# EasyEDA schematic SCH_WHITEBoard ESP32 S2 Saola_2021-06-30.json

## Sheets
1 Sheet_1: TITLE: ESP32 S2 Saola; REV: 1.0; Date: 2020-12-30; Sheet: 1/1; Drawn By: dekip; Company: Your Company
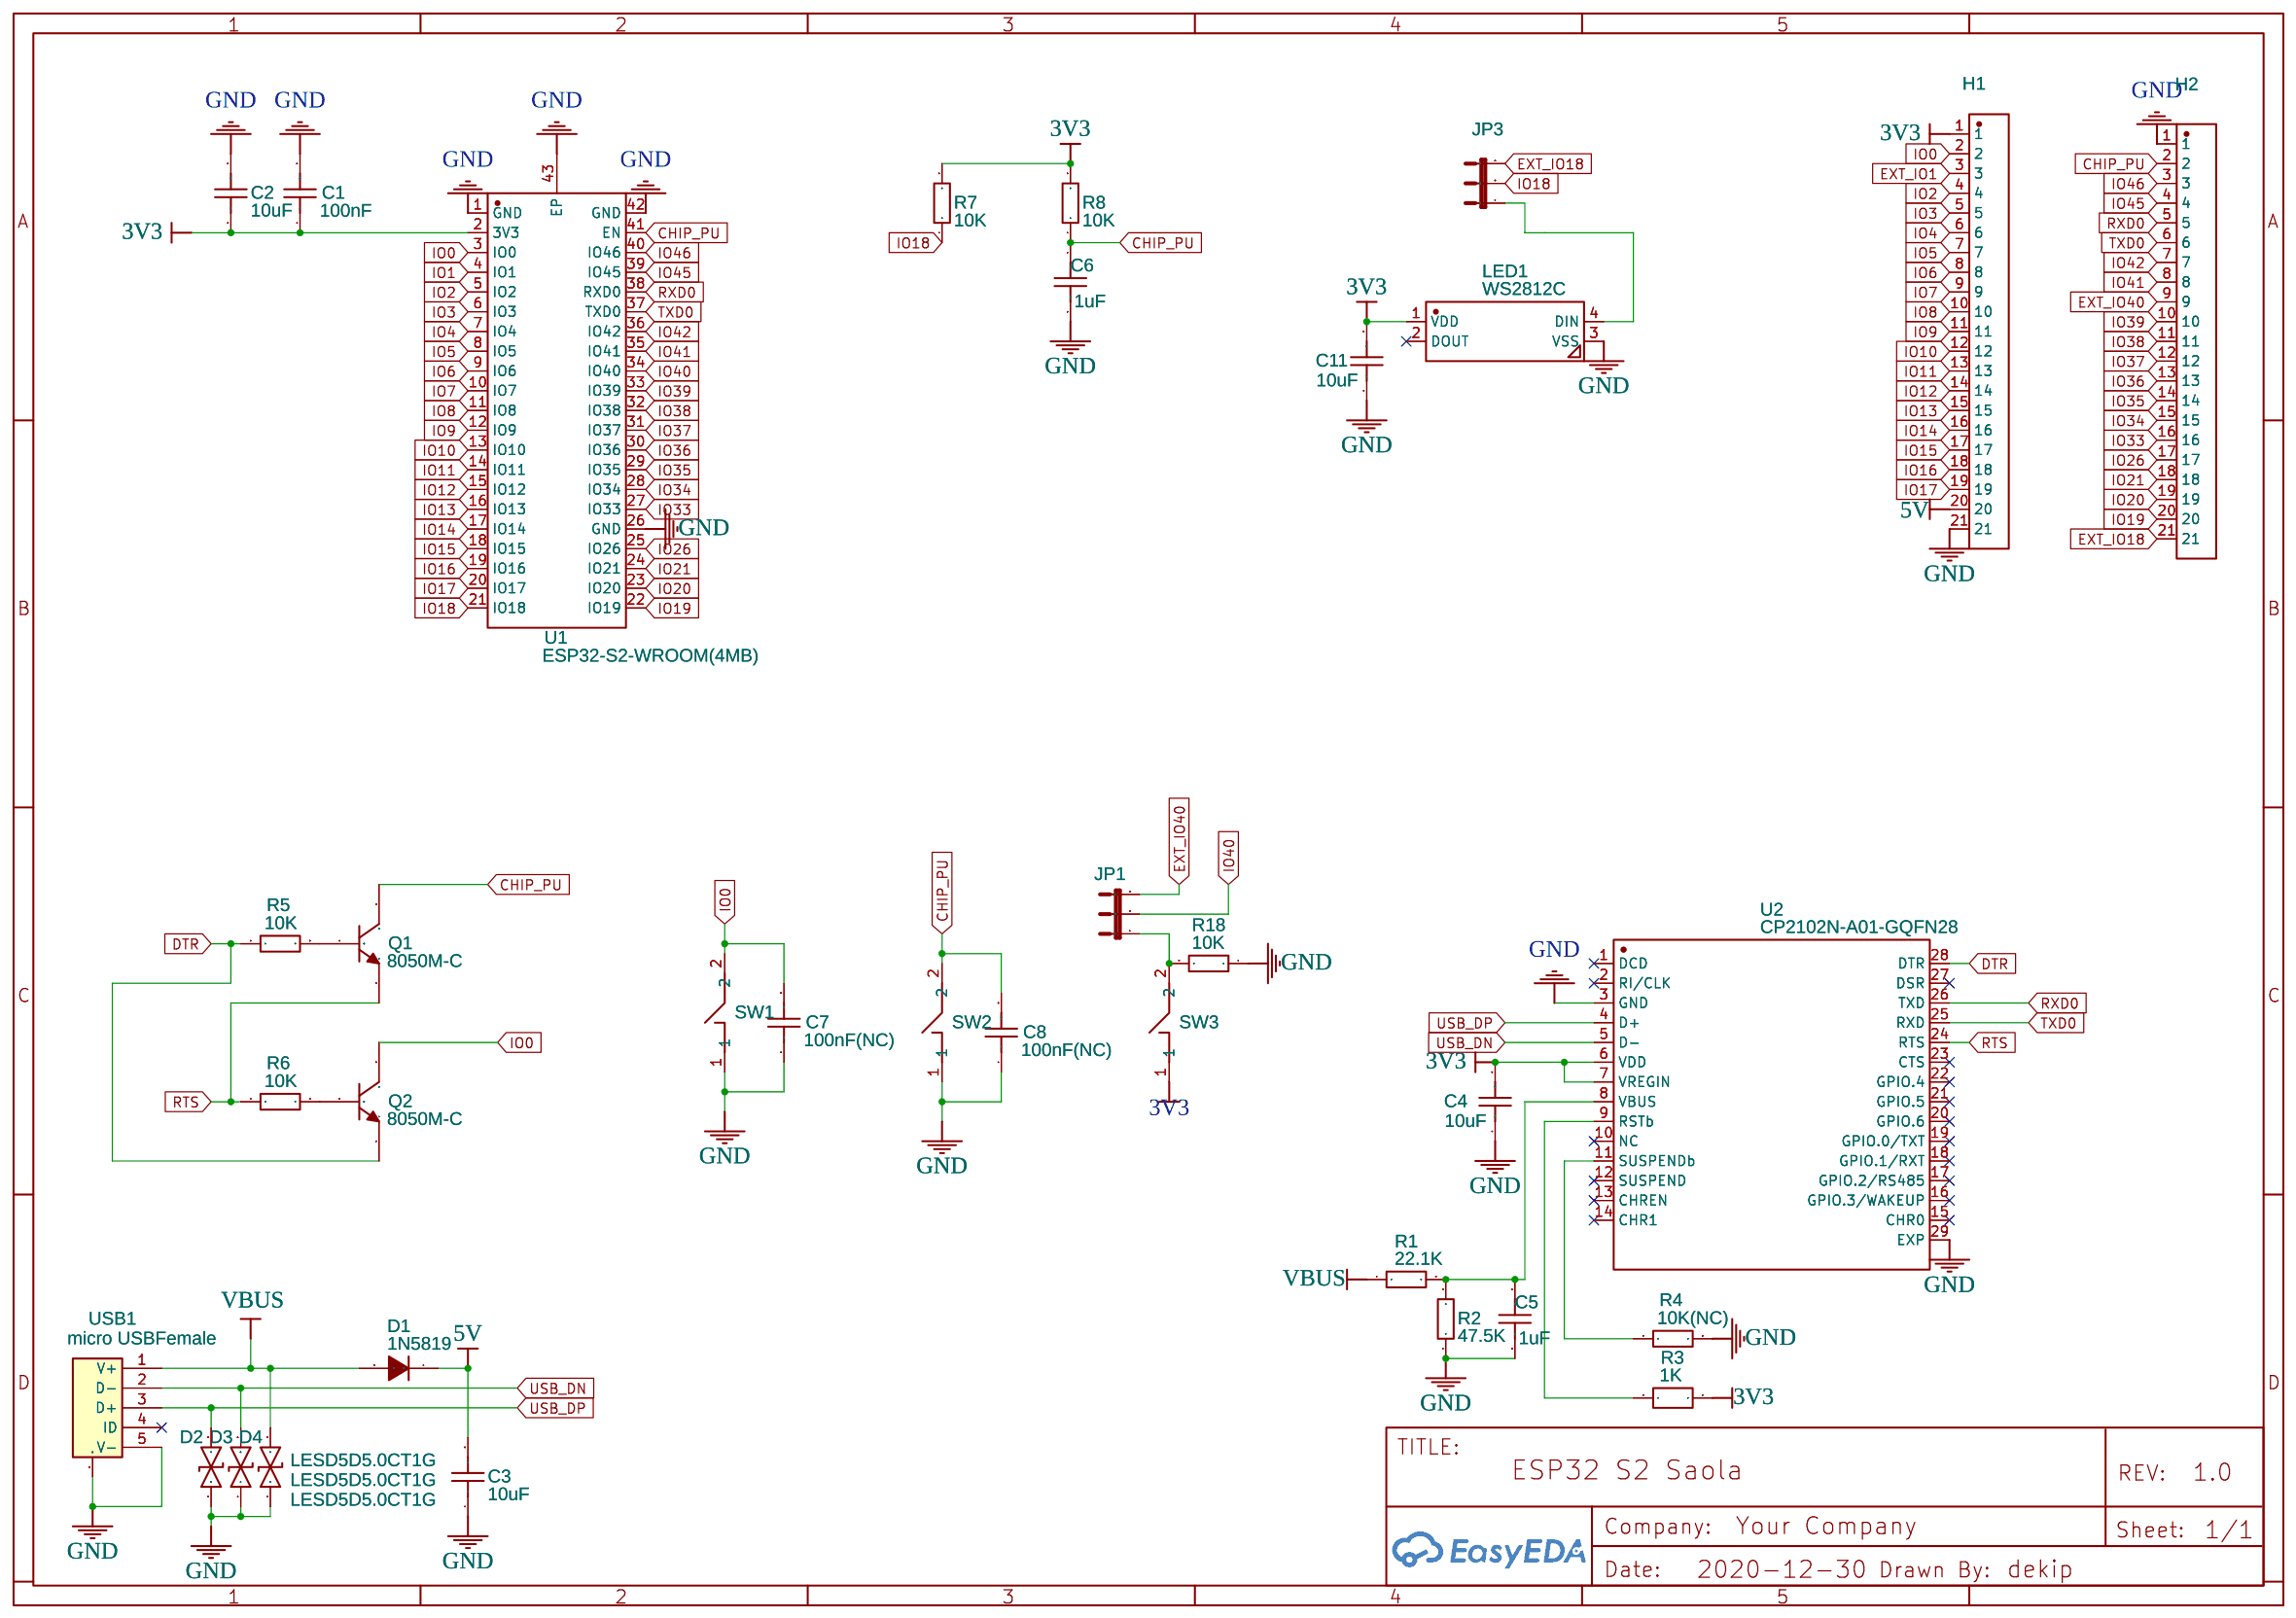
[diagram p0: Sheet_1]
2 Sheet_2: TITLE: Sheet_2; Date: 2020-12-31
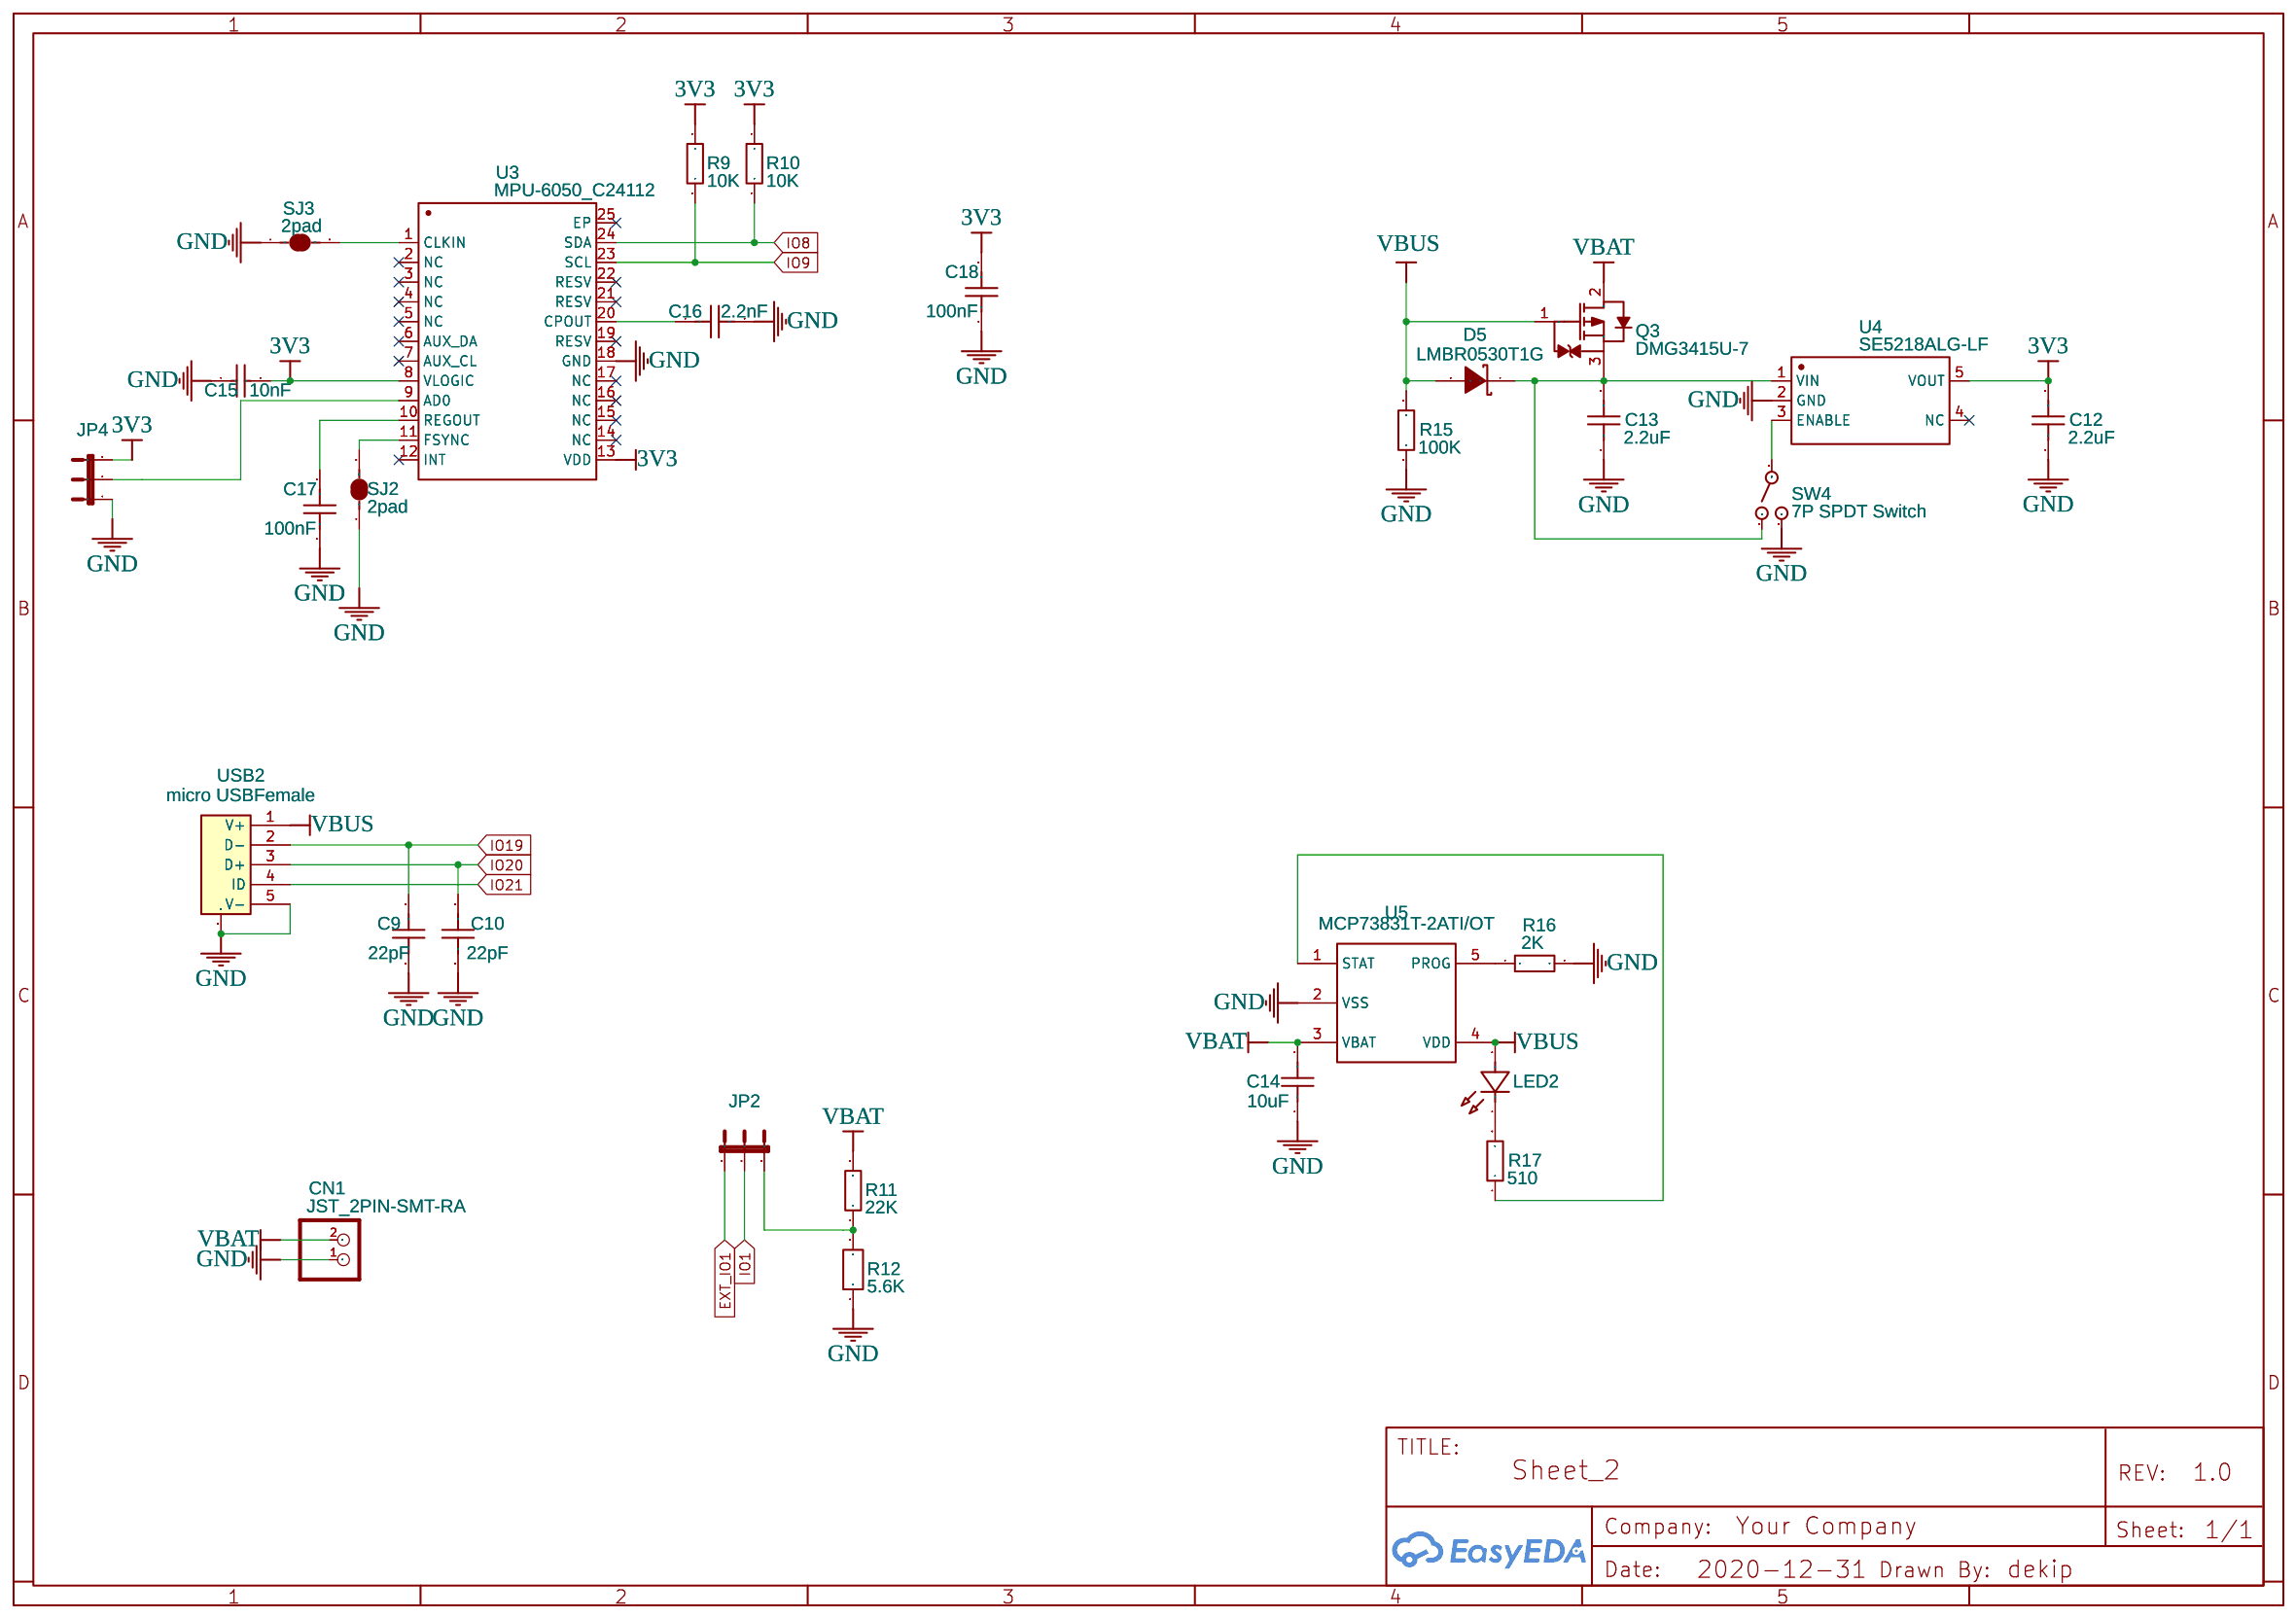
[diagram p1: Sheet_2]

## Parts
sheet Sheet_1
C1  100nF  [C0805]
C2  10uF  [C0805]
C3  10uF  [C0805]
C4  10uF  [C0805]
C5  1uF  [C0805]
C6  1uF  [C0805]
C7  100nF(NC)  [C0805]
C8  100nF(NC)  [C0805]
C11  10uF  [C0805]
D1  1N5819  [SOD-123F_L2.8-W1.8-LS3.7-RD]
D2  LESD5D5.0CT1G  [SOD-523_L1.2-W0.8-LS1.6-BI]
D3  LESD5D5.0CT1G  [SOD-523_L1.2-W0.8-LS1.6-BI]
D4  LESD5D5.0CT1G  [SOD-523_L1.2-W0.8-LS1.6-BI]
H1  X6511WV-21H-C30D60  [HDR-TH_21P-P2.54-V-M]
H2  X6511WV-21H-C30D60  [HDR-TH_21P-P2.54-V-M]
JP1  JUMPER-3SMD  [SJ_3]
JP3  JUMPER-3SMD  [SJ_3]
LED1  WS2812C  [LED-SMD_4P-L5.0-W5.0-TL]
Q1  8050M-C  [SOT-23-3_L3.0-W1.7-P0.95-LS2.9-BR]
Q2  8050M-C  [SOT-23-3_L3.0-W1.7-P0.95-LS2.9-BR]
R1  22.1K  [R0805]
R2  47.5K  [R0805]
R3  1K  [R0805]
R4  10K(NC)  [R0805]
R5  10K  [R0805]
R6  10K  [R0805]
R7  10K  [R0805]
R8  10K  [R0805]
R18  10K  [R0805]
SW1  1TS002B-1900-4300  [SW-SMD_L6.0-W3.5-LS8.0]
SW2  1TS002B-1900-4300  [SW-SMD_L6.0-W3.5-LS8.0]
SW3  1TS002B-1900-4300  [SW-SMD_L6.0-W3.5-LS8.0]
U1  ESP32-S2-WROOM(4MB)  [WIFI-SMD_ESP32-S2-WROVER-I]
U2  CP2102N-A01-GQFN28  [QFN-28_L5.0-W5.0-P0.50-BL-EP3.3]
USB1  micro USBFemale  [MICRO-USB-SMD_5P-P0.65-H-F_C10418]
sheet Sheet_2
C9  22pF  [C0805]
C10  22pF  [C0805]
C12  2.2uF  [C0805]
C13  2.2uF  [C0805]
C14  10uF  [C0805]
C15  10nF  [C0805]
C16  2.2nF  [C0805]
C17  100nF  [C0805]
C18  100nF  [C0805]
CN1  JST_2PIN-SMT-RA  [JST-PH-2-SMT-RA]
D5  LMBR0530T1G  [SOD-123_L2.8-W1.8-LS3.7-RD]
JP2  JUMPER-3SMD  [SJ_3]
JP4  JUMPER-3SMD  [SJ_3]
LED2  GBD-C171KSKT-DZ  [LED0805-RD]
Q3  DMG3415U-7  [SOT-23-3_L2.9-W1.6-P1.90-LS2.8-BR-CW]
R9  10K  [R0805]
R10  10K  [R0805]
R11  22K  [R0805]
R12  5.6K  [R0805]
R15  100K  [R0805]
R16  2K  [R0805]
R17  510  [R0805]
SJ2  2pad  [SJ_2S-TRACE]
SJ3  2pad  [SJ_2S-TRACE]
SW4  7P SPDT Switch  [SW-TH_MSK12C02]
U3  MPU-6050_C24112  [QFN-24_L4.0-W4.0-P0.50-BL-EP2.6]
U4  SE5218ALG-LF  [SOT-23-5_L3.0-W1.7-P0.95-LS2.8-BR]
U5  MCP73831T-2ATI/OT  [SOT-23-5_L3.0-W1.7-P0.95-LS2.8-BR]
USB2  micro USBFemale  [MICRO-USB-SMD_5P-P0.65-H-F_C10418]

## Library data of the parts
C1 C7 C8 C17 C18 = C0805C104J5RAC7800: Supplier: LCSC; Supplier Part: C599848; Manufacturer: KEMET; Contributor: LCSC
C2-C4 C11 C14 = C0805X106K010T: Supplier: LCSC; Supplier Part: C340314; Manufacturer: Holy Stone Enterprise; Contributor: LCSC
C5 C6 = C0805X105K050T: Supplier: LCSC; Supplier Part: C340303; Manufacturer: Holy Stone Enterprise; Contributor: LCSC
D1 = 1N5819HW1-7-F: Supplier: LCSC; Manufacturer: DIODES; Contributor: LCSC; Supplier Part: C117948; LCSC Assembly: Yes; SMT Type: Extend
D2-D4 = LESD5D5.0CT1G: Supplier: LCSC; Supplier Part: C383211; Manufacturer: Leshan Radio; Contributor: LCSC; SMT Type: Extend; JLCPCB SMD: Yes
H1 H2 = X6511WV-21H-C30D60: Supplier: LCSC; Supplier Part: C725953; Manufacturer: XKB Connectivity; Contributor: LCSC
JP1-JP4 = JUMPER-3SMD: Contributor: SparkFun
LED1 = WS2812C: Supplier: LCSC; Manufacturer: Worldsemi; Contributor: LCSC; Supplier Part: C114587; SMT Type: Extend; JLCPCB SMD: Yes
Q1 Q2 = 8050M-C: Supplier: LCSC; Supplier Part: C305454; Manufacturer: BLUE ROCKET; Contributor: LCSC
R1 = CR0805-FX-2212ELF: Supplier: LCSC; Supplier Part: C204311; Manufacturer: BOURNS; Contributor: LCSC
R2 = AR05DTCW4752: Supplier: LCSC; Supplier Part: C319613; Manufacturer: Viking Tech; Contributor: LCSC
R3 = ERJPB6B1001V: Supplier: LCSC; Supplier Part: C413712; Manufacturer: PANASONIC; Contributor: LCSC
R4-R10 R18 = RN73H2ATTD1002B25: Supplier: LCSC; Supplier Part: C186277; Manufacturer: KOA Speer Elec; Contributor: LCSC
SW1-SW3 = 1TS002B-1900-4300: Supplier: LCSC; Supplier Part: C318823; Manufacturer: HYP; Contributor: LCSC
U1 = ESP32-S2-WROOM(4MB): Supplier: LCSC; Supplier Part: C701327; Manufacturer: Espressif Systems; Contributor: LCSC
U2 = CP2102N-A01-GQFN28: Supplier: LCSC; Manufacturer: SILICON LABS; Contributor: LCSC; Supplier Part: C105167; SMT Type: Extend; JLCPCB SMD: Yes
USB1 USB2 = micro USBFemale: Supplier: LCSC; Manufacturer: ValuePro; image: //image.lceda.cn/szlcsc/C10418.jpg; Supplier Part: C10418
C9 C10 = C0805C220K5RACAUTO: Supplier: LCSC; Supplier Part: C129647; Manufacturer: KEMET; Contributor: LCSC
C12 C13 = CC0805MRY5V7BB225: Supplier: LCSC; Supplier Part: C527243; Manufacturer: YAGEO; Contributor: LCSC
C15 = C0805X103K201T: Supplier: LCSC; Manufacturer: HEC; Supplier Part: C105948
C16 = C0805X222K501T: Supplier: LCSC; Supplier Part: C340306; Manufacturer: Holy Stone Enterprise; Contributor: LCSC
CN1 = JST_2PIN-SMT-RA: JST 2-Pin Connectors of various flavors; Contributor: Adafruit
D5 = LMBR0530T1G: Supplier: LCSC; Manufacturer: LRC; image: //image.lceda.cn/szlcsc/C18863.jpg; Supplier Part: C18863; SMT Type: Extend; JLCPCB SMD: Yes
LED2 = GBD-C171KSKT-DZ: Supplier: LCSC; Supplier Part: C712082; Manufacturer: GBG; Contributor: LCSC
Q3 = DMG3415U-7: Supplier: LCSC; Supplier Part: C96616; Manufacturer: Diodes Incorporated; Contributor: LCSC; SMT Type: Extend; JLCPCB SMD: Yes
R11 = 0805W8F2202T5E: Supplier: LCSC; Manufacturer: UniOhm; Supplier Part: C17560; SMT Type: Basic; JLCPCB SMD: Yes
R12 = ERJ6GEYJ562V: Supplier: LCSC; Supplier Part: C413194; Manufacturer: PANASONIC; Contributor: LCSC
R15 = ERJ6RBD1003V: Supplier: LCSC; Supplier Part: C336855; Manufacturer: PANASONIC; Contributor: LCSC
R16 = RMS10FT2001: Supplier: LCSC; Supplier Part: C212356; Manufacturer: TA-I Tech; Contributor: LCSC
R17 = RMC08055105%N: Supplier: LCSC; Supplier Part: C269737; Manufacturer: Tyohm; Contributor: LCSC
SJ2 SJ3 = SOLDERJUMPER-OLDTRACE: Solder Jumper; Contributor: SparkFun
SW4 = 7P SPDT Switch: Supplier: LCSC; Supplier Part: C431540; Manufacturer: SHOU HAN; Manufacturer Part: MSK12C02; Contributor: LCSC
U3 = MPU-6050_C24112: sourceId: 1T5FDZYC8; Supplier: LCSC; Manufacturer: InvenSense; Manufacturer Part: MPU-6050; image: //image.lceda.cn/szlcsc/C24112.jpg; Supplier Part: C24112; SMT Type: Basic; JLCPCB SMD: Yes
U4 = SE5218ALG-LF: Supplier: LCSC; Manufacturer: SEAWARD; Supplier Part: C118233; SMT Type: Extend; JLCPCB SMD: Yes
U5 = MCP73831T-2ATI/OT: Supplier: LCSC; Manufacturer: MICROCHIP; image: //image.lceda.cn/szlcsc/C14879.jpg; Supplier Part: C14879; SMT Type: Extend; JLCPCB SMD: Yes

## Nets
3V3: C1.1 C2.1 C4.2 C11.2 C12.2 C15.2 C18.2 H1.1 JP4.3 LED1.1(VDD) R3.2 R7.2 R8.2 R9.1 R10.1 SW3.1 U1.2(3V3) U2.6(VDD) U2.7(VREGIN) U3.8(VLOGIC) U3.13(VDD) U4.5(VOUT)
5V: C3.2 D1.1(K) H1.20
GND: C1.2 C2.2 C3.1 C4.1 C5.2 C6.2 C7.1 C8.1 C9.2 C10.2 C11.1 C12.1 C13.1 C14.1 C15.1 C16.2 C17.1 C18.1 CN1.1(2) D2.1 D3.1 D4.1 H1.21 H2.1 JP4.1 LED1.3(VSS) R2.1 R4.2 R12.1 R15.1 R16.2 R18.1 SJ2.1 SJ3.1 SW1.1 SW2.1 SW4.1 U1.1(GND) U1.26(GND) U1.42(GND) U1.43(EP) U2.3(GND) U2.29(EXP) U3.18(GND) U4.2(GND) U5.2(VSS) USB1.0(MTN) USB1.5(V-) USB2.0(MTN) USB2.5(V-)
VBAT: C14.2 CN1.2(1) Q3.2(D) R11.2 U5.3(VBAT)
VBUS: D1.2(A) D4.2 D5.2(A) LED2.2(A) Q3.1(G) R1.1 R15.2 U5.4(VDD) USB1.1(V+) USB2.1(V+)
CHIP_PU: C6.1 C8.2 H2.2 Q1.3(C) R8.1 SW2.2 U1.41(EN)
DTR: Q2.2(E) R5.1 U2.28(DTR)
EXT_IO1: H1.3 JP2.1
EXT_IO18: H2.21 JP3.3
EXT_IO40: H2.9 JP1.3
IO0: C7.2 H1.2 Q2.3(C) SW1.2 U1.3(IO0)
IO1: JP2.2 U1.4(IO1)
IO2: H1.4 U1.5(IO2)
IO3: H1.5 U1.6(IO3)
IO4: H1.6 U1.7(IO4)
IO5: H1.7 U1.8(IO5)
IO6: H1.8 U1.9(IO6)
IO7: H1.9 U1.10(IO7)
IO8: H1.10 R10.2 U1.11(IO8) U3.24(SDA)
IO9: H1.11 R9.2 U1.12(IO9) U3.23(SCL)
IO10: H1.12 U1.13(IO10)
IO11: H1.13 U1.14(IO11)
IO12: H1.14 U1.15(IO12)
IO13: H1.15 U1.16(IO13)
IO14: H1.16 U1.17(IO14)
IO15: H1.17 U1.18(IO15)
IO16: H1.18 U1.19(IO16)
IO17: H1.19 U1.20(IO17)
IO18: JP3.2 R7.1 U1.21(IO18)
IO19: C9.1 H2.20 U1.22(IO19) USB2.2(D-)
IO20: C10.1 H2.19 U1.23(IO20) USB2.3(D+)
IO21: H2.18 U1.24(IO21) USB2.4(ID)
IO26: H2.17 U1.25(IO26)
IO33: H2.16 U1.27(IO33)
IO34: H2.15 U1.28(IO34)
IO35: H2.14 U1.29(IO35)
IO36: H2.13 U1.30(IO36)
IO37: H2.12 U1.31(IO37)
IO38: H2.11 U1.32(IO38)
IO39: H2.10 U1.33(IO39)
IO40: JP1.2 U1.34(IO40)
IO41: H2.8 U1.35(IO41)
IO42: H2.7 U1.36(IO42)
IO45: H2.4 U1.39(IO45)
IO46: H2.3 U1.40(IO46)
RTS: Q1.2(E) R6.1 U2.24(RTS)
RXD0: H2.5 U1.38(RXD0) U2.26(TXD)
TXD0: H2.6 U1.37(TXD0) U2.25(RXD)
USB_DN: D3.2 U2.5(D-) USB1.2(D-)
USB_DP: D2.2 U2.4(D+) USB1.3(D+)
Net-(C5-1): C5.1 R1.2 R2.2 U2.8(VBUS)
Net-(C13-2): C13.2 D5.1(K) Q3.3(S) SW4.3 U4.1(VIN)
Net-(C16-1): C16.1 U3.20(CPOUT)
Net-(C17-2): C17.2 U3.10(REGOUT)
Net-(JP1-1): JP1.1 R18.2 SW3.2
Net-(JP2-3): JP2.3 R11.1 R12.2
Net-(JP3-1): JP3.1 LED1.4(DIN)
Net-(JP4-2): JP4.2 U3.9(AD0)
Net-(LED2-1): LED2.1(K) R17.2
Net-(Q1-1): Q1.1(B) R5.2
Net-(Q2-1): Q2.1(B) R6.2
Net-(R3-1): R3.1 U2.9(RSTb)
Net-(R4-1): R4.1 U2.11(SUSPENDb)
Net-(R16-1): R16.1 U5.5(PROG)
Net-(R17-1): R17.1 U5.1(STAT)
Net-(SJ2-2): SJ2.2 U3.11(FSYNC)
Net-(SJ3-2): SJ3.2 U3.1(CLKIN)
Net-(SW4-2): SW4.2(COM) U4.3(ENABLE)

Not connected (* = marked no-connect by the designer): LED1 2(DOUT)*; U2 1(DCD)* 2(RI/CLK)* 10(NC)* 12(SUSPEND)* 13(CHREN)* 14(CHR1)* 15(CHR0)* 16(GPIO.3/WAKEUP)* 17(GPIO.2/RS485)* 18(GPIO.1/RXT)* 19(GPIO.0/TXT)* 20(GPIO.6)* 21(GPIO.5)* 22(GPIO.4)* 23(CTS)* 27(DSR)*; U3 2(NC)* 3(NC)* 4(NC)* 5(NC)* 6(AUX_DA)* 7(AUX_CL)* 12(INT)* 14(NC)* 15(NC)* 16(NC)* 17(NC)* 19(RESV)* 21(RESV)* 22(RESV)* 25(EP)*; U4 4(NC)*; USB1 4(ID)*
